# EAGLE board Controller Board (EAGLE 9.1.0), part 1 of 2
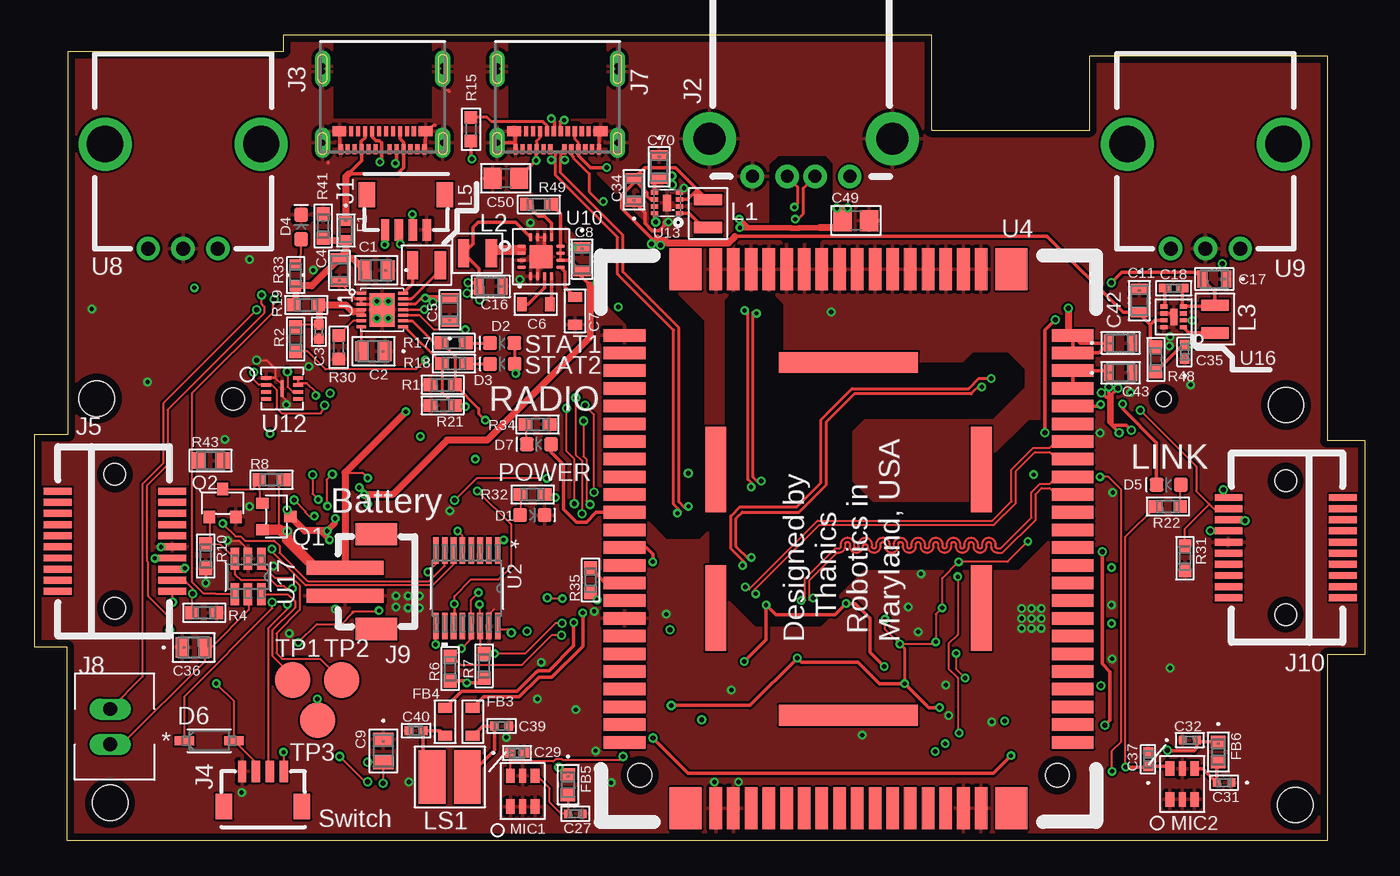
[diagram p6: board, top side]
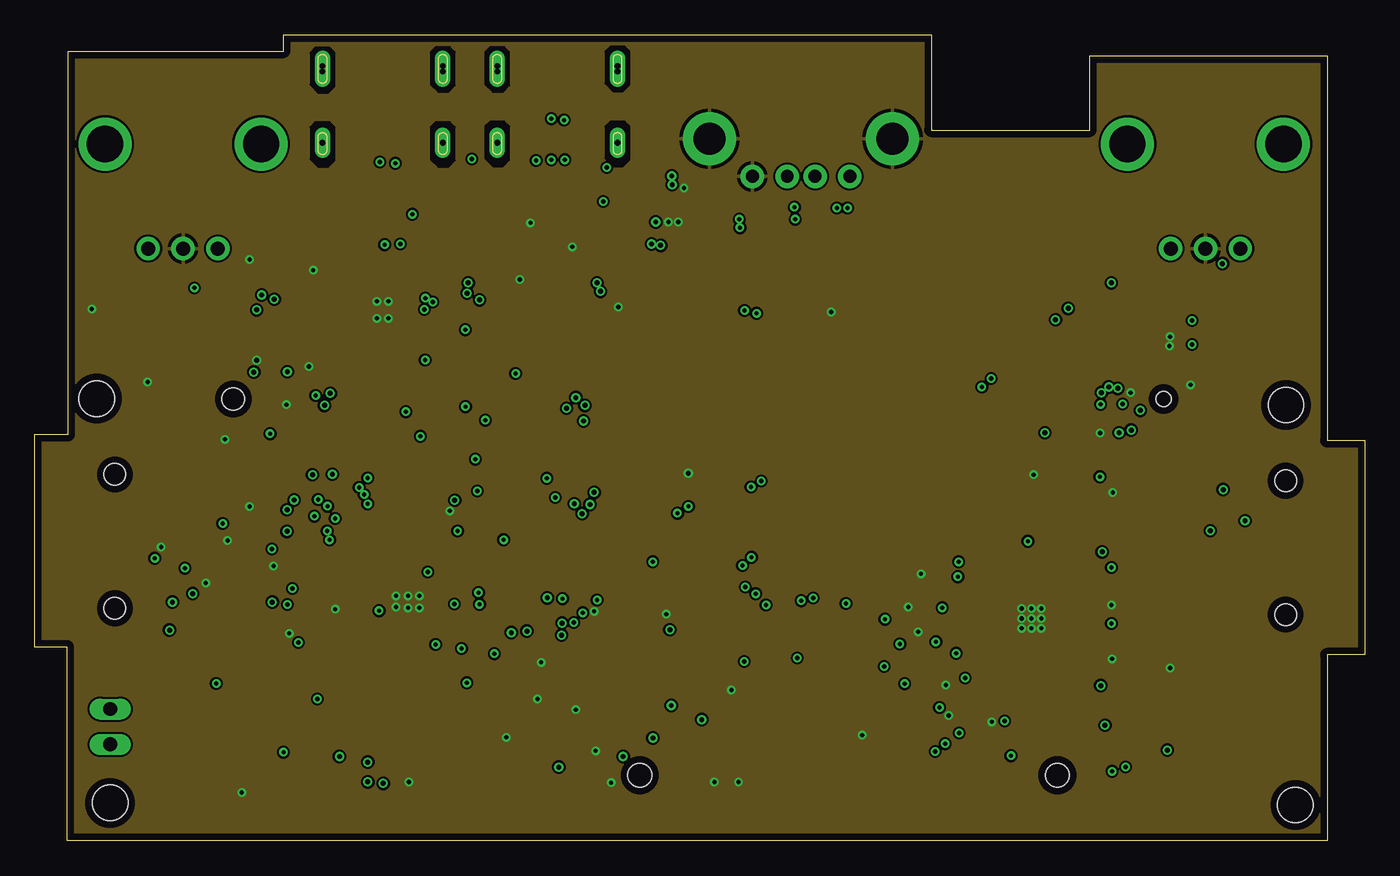
[diagram p7: board, inner layer Route2]
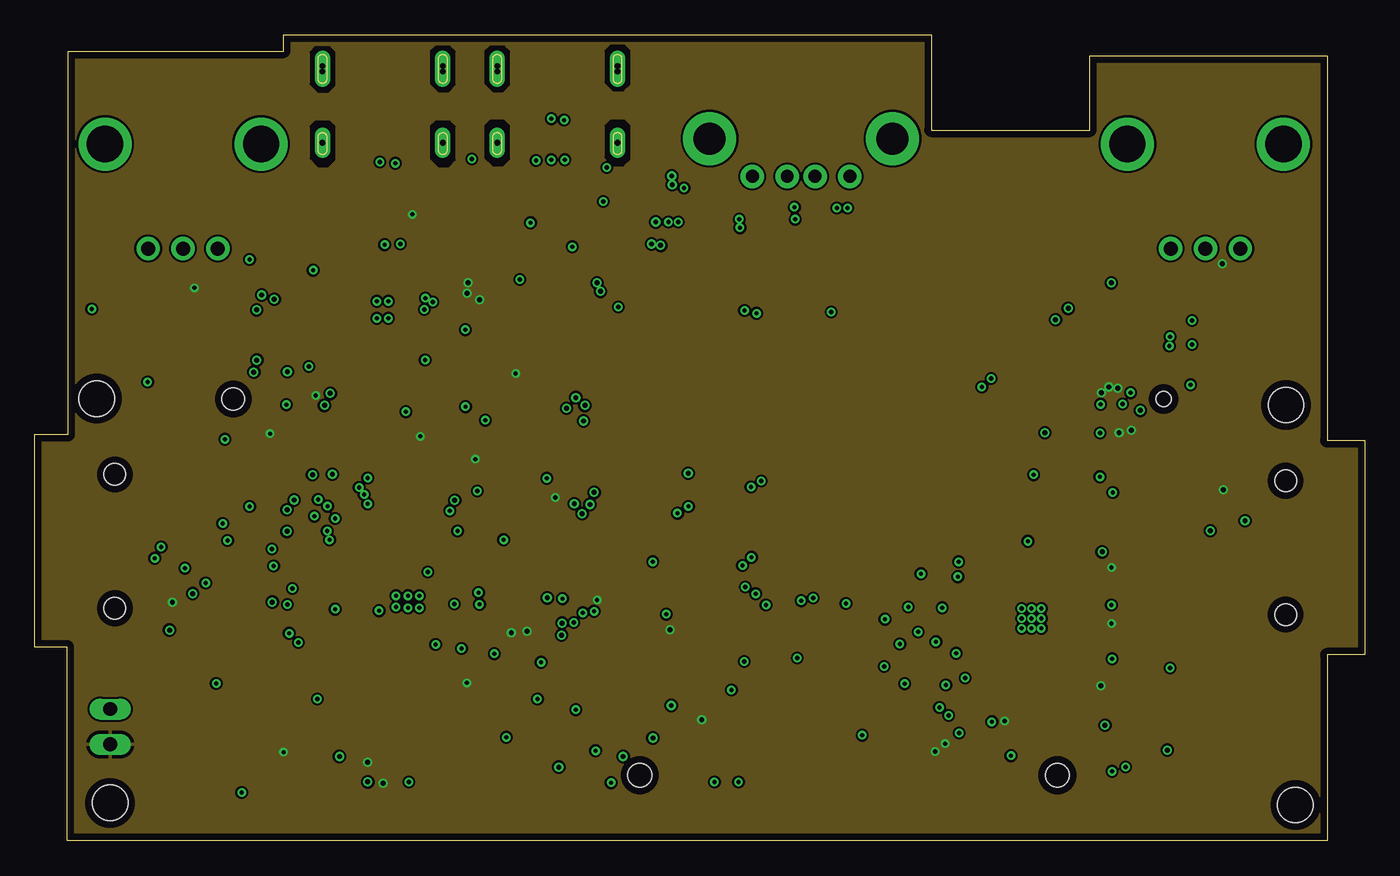
[diagram p8: board, inner layer Route15]
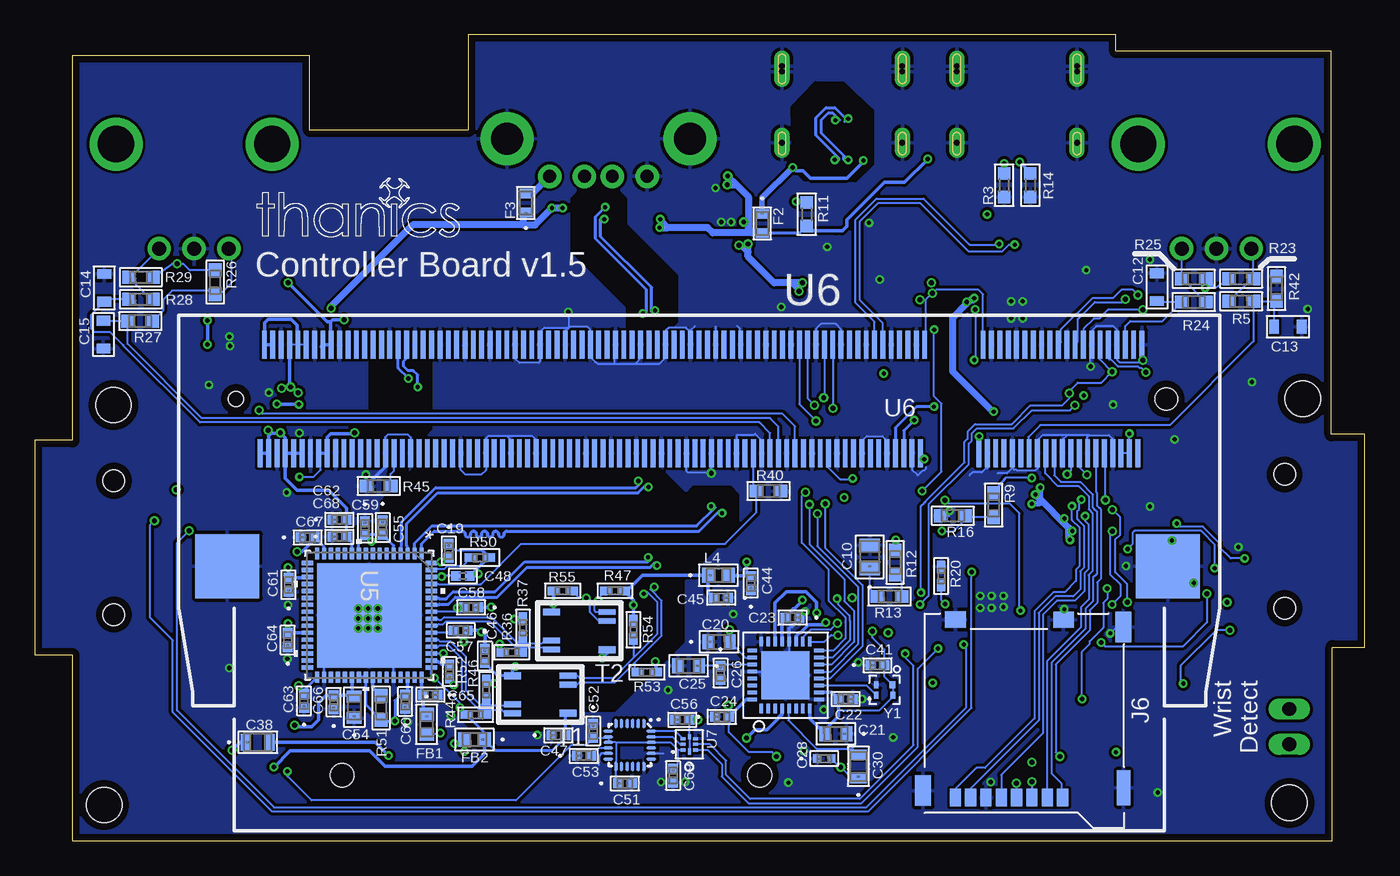
[diagram p9: board, bottom side, seen from below]

Size 95.48 x 57.84 mm. Coordinates in mm from the lower left corner, seen from the top.
Outline: 2.31,0 2.31,13.89 0,13.89 0,29.16 2.39,29.16 2.39,56.67 17.86,56.67 17.86,57.84 64.36,57.84 64.36,51 75.74,51 75.74,56.34 92.79,56.34 92.79,28.73 95.48,28.73 95.48,13.34 92.79,13.34 92.79,0 2.31,0
Copper layers (1*2*15*16): Top 0.035mm / dielectric 0.2mm / Route2 0.035mm / dielectric 1.2mm / Route15 0.035mm / dielectric 0.2mm / Bottom 0.035mm
Design rules "Elecrow_4-layer_PCB_eagle_rule": minimum track width 6mil, minimum drill 12mil, track to track 6mil, track to pad 6mil, pad to pad 6mil, via to via 8mil, smd to smd 0mil, copper to edge 20mil, drill to drill 10mil, minimum pad ring 6mil, minimum via ring 6mil, stop-mask expansion 0mil, vias tented up to drill 100mil, thermal gap 10mil
Holes 2.54 mm at 90.5,2.57 5.41,2.72 89.84,31.27 4.45,31.72

## Footprints (pad centres in the part's own frame; a part is rotated, then mirrored left to right if it is on the bottom)
0805 = smd 0.965 x 1.448: 1 -0.826,0; 2 0.826,0
C0402 = smd 0.7 x 0.7: 1 -0.5,0; 2 0.5,0
G-21 = smd 0.711 x 1.245: 1 -0.851,0; 2 0.851,0
0603_CAPACITOR = smd 0.701 x 1.001: 1 -1.001,0; 2 1.001,0
CC0402N-M = smd 0.864 x 0.61: 1 -0.635,0; 2 0.635,0
0402-M = smd 0.711 x 0.711: 1 -0.508,0; 2 0.508,0
0603-M = smd 0.813 x 1.067: 1 -0.775,0; 2 0.775,0
G-155-M = smd 0.559 x 0.61: 1 -0.521,0; 2 0.521,0
YAG_CC0402-M = smd 0.61 x 0.66: 1 -0.521,0; 2 0.521,0
C0805 = smd 1.3 x 1.5: 1 -0.95,0; 2 0.95,0
LED-0603 = smd 1 x 1: A -0.877,0; C 0.877,0
SOD123-M = smd 1.416 x 0.652: A 1.776,0; C -1.776,0
FUS_VISHAY_MFU0603 = smd 0.699 x 0.94: 1 -0.679,0; 2 0.679,0
IND_BLM18_0603-M = smd 0.914 x 1.041: 1 -0.724,0; 2 0.724,0
JST_SH_4POS = smd 0.6 x 1.55: 1 -1.5,0; 2 -0.5,0; 3 0.5,0; 4 1.5,0 | smd 1.2 x 1.8: P$5 -2.8,2.525; P$6 2.8,2.525
USB_A_RECEPT = drill 0.92 pad 1.676: 1 -3.5,0; 2 -1,0; 3 1,0; 4 3.5,0 | drill 2.3 pad 3.81: 5 -6.57,-2.71; 6 6.57,-2.71
MOLEX_105450-0101 = smd 0.3 x 0.7: A1 -3,3.77; A2 -2.5,3.77; A3 -2,3.77; A4 -1.5,3.77; A5 -1,3.77; A6 -0.5,3.77; A7 0.5,3.77; A8 1,3.77; A9 1.5,3.77; A10 2,3.77; A11 2.5,3.77; A12 3,3.77; B2 2.25,2.47; B3 1.75,2.47; B4 1.25,2.47; B5 0.75,2.47; B6 0.25,2.47; B7 -0.25,2.47; B8 -0.75,2.47; B9 -1.25,2.47; B10 -1.75,2.47; B11 -2.25,2.47 | smd 1 x 0.7: B1 3.1,2.47; B12 -3.1,2.47 | drill 0.4 pad 1.1 long: P$1 -4.32,3.3; P$2 -4.32,-2.2; P$3 -4.32,-1.8; P$4 4.32,3.3; P$5 4.32,-2.2; P$6 4.32,-1.8
EDGE_CONNECTOR_20POS = smd 0.5 x 2: 1 -3.6,0; 2 -2.8,0; 3 -2,0; 4 -1.2,0; 5 -0.4,0; 6 0.4,0; 7 1.2,0; 8 2,0; 9 2.8,0; 10 3.6,0; 11 3.6,8.2; 12 2.8,8.2; 13 2,8.2; 14 1.2,8.2; 15 0.4,8.2; 16 -0.4,8.2; 17 -1.2,8.2; 18 -2,8.2; 19 -2.8,8.2; 20 -3.6,8.2 | hole 1.55: -4.8,4.1; 4.8,4.1
MICROSD = smd 0.8 x 1.24: 1 -4.4,0; 2 -3.3,0; 3 -2.2,0; 4 -1.1,0; 5 0,0; 6 1.1,0; 7 2.2,0; 8 3.3,0 | smd 0.95 x 2.5: 9 -8.775,-0.7 | smd 1.15 x 2.2: 10 5.615,-0.5; 11 -8.775,-12.23 | smd 1.5 x 1.15: 12 -4.47,-12.755; 13 3.31,-12.775
XH_CONNECTOR = drill 1.001 long: 1 -1.27,0; 2 1.27,0
B2B-PH-SM4-TB(LF)(SN) = smd 1 x 5.5: 1 -1,0; 2 1,0 | smd 1.6 x 3: 3 3.4,2.25; 4 -3.4,2.25
1008 = smd 0.8 x 2: P$1 -1,0; P$2 1,0
470NH_INDUCTOR = smd 0.8 x 2: P$1 -1,0; P$2 1,0
SPEAKER = smd 1.905 x 3.81: 1 -1.27,0.889; 2 1.27,0.889
SISONIC_MICROPHONE = smd 1.032 x 0.622: 1 -1.104,0.884; 3 -1.104,-0.884; 4 1.104,-0.884; 6 1.104,0.884 | smd 1.032 x 0.5: 2 -1.104,0; 5 1.104,0
SOT-23_(TO-236AB) = smd 0.8 x 0.9: D 0,-1; G 0.95,1; S -0.95,1
RC0603N-M = smd 0.965 x 0.914: 1 -0.876,0; 2 0.876,0
R0603 = smd 0.9 x 0.9: 1 -0.85,0; 2 0.85,0
RC0402N-M = smd 0.864 x 0.61: 1 -0.66,0; 2 0.66,0
RC0603N = smd 0.762 x 0.813: 1 -0.775,0; 2 0.775,0
RC0805N = smd 1.006 x 1.2: 1 -0.853,0; 2 0.853,0
YAG_R0402-M = smd 0.66 x 0.66: 1 -0.508,0; 2 0.508,0
ALT4532 = smd 1.2 x 0.41: 1 -1.99,-1.35; 2 -1.99,-0.7; 4 1.99,1.35; 5 1.99,0.7 | smd 1.2 x 0.5: 3 -1.99,1.35; 6 1.99,-1.35
B2,54 = smd 2.54 x 2.54: TP 0,0
AAT3620_TDFN = smd 0.7 x 0.22: 1 -1.5,1.2; 2 -1.5,0.8; 3 -1.5,0.4; 4 -1.5,0; 5 -1.5,-0.4; 6 -1.5,-0.8; 7 -1.5,-1.2; 8 1.5,-1.2; 9 1.5,-0.8; 10 1.5,-0.4; 11 1.5,0; 12 1.5,0.4; 13 1.5,0.8; 14 1.5,1.2 | smd 1.8 x 2.4: EP 0,0
21-0055H_16-M = smd 1.905 x 0.406: 1 -2.705,2.223; 2 -2.705,1.587; 3 -2.705,0.953; 4 -2.705,0.318; 5 -2.705,-0.318; 6 -2.705,-0.953; 7 -2.705,-1.587; 8 -2.705,-2.223; 9 2.705,-2.223; 10 2.705,-1.587; 11 2.705,-0.953; 12 2.705,-0.318; 13 2.705,0.318; 14 2.705,0.953; 15 2.705,1.587; 16 2.705,2.223
PDDL2450_SOCKET = smd 0.9 x 3: 1 14.605,16.09; 2 13.335,16.09; 3 12.065,16.09; 4 10.795,16.09; 5 9.525,16.09; 6 8.255,16.09; 7 6.985,16.09; 8 5.715,16.09; 9 4.445,16.09; 10 3.175,16.09; 11 1.905,16.09; 12 0.635,16.09; 13 -0.635,16.09; 14 -1.905,16.09; 15 -3.175,16.09; 16 -4.445,16.09; 17 -5.715,16.09; 18 -6.985,16.09; 19 -8.255,16.09; 20 -9.525,16.09; 21 -10.795,16.09; 22 -12.065,16.09; 23 -13.335,16.09; 24 -14.605,16.09; 41 -14.605,-16.09; 42 -13.335,-16.09; 43 -12.065,-16.09; 44 -10.795,-16.09; 45 -9.525,-16.09; 46 -8.255,-16.09; 47 -6.985,-16.09; 48 -5.715,-16.09; 49 -4.445,-16.09; 50 -3.175,-16.09; 51 -1.905,-16.09; 52 -0.635,-16.09; 53 0.635,-16.09; 54 1.905,-16.09; 55 3.175,-16.09; 56 4.445,-16.09; 57 5.715,-16.09; 58 6.985,-16.09; 59 8.255,-16.09; 60 9.525,-16.09; 61 10.795,-16.09; 62 12.065,-16.09; 63 13.335,-16.09; 64 14.605,-16.09 | smd 3 x 0.9: 25 -19.34,9.53; 26 -19.34,8.26; 27 -19.34,6.99; 28 -19.34,5.72; 29 -19.34,4.45; 30 -19.34,3.18; 31 -19.34,1.91; 32 -19.34,0.64; 33 -19.34,-0.63; 34 -19.34,-1.9; 35 -19.34,-3.17; 36 -19.34,-4.44; 37 -19.34,-5.71; 38 -19.34,-6.98; 39 -19.34,-8.25; 40 -19.34,-9.52; 65 19.34,-9.52; 66 19.34,-8.25; 67 19.34,-6.98; 68 19.34,-5.71; 69 19.34,-4.44; 70 19.34,-3.17; 71 19.34,-1.9; 72 19.34,-0.63; 73 19.34,0.64; 74 19.34,1.91; 75 19.34,3.18; 76 19.34,4.45; 77 19.34,5.72; 78 19.34,6.99; 79 19.34,8.26; 80 19.34,9.53 | smd 1.5 x 10: EP1 -12.65,0; EP2 12.65,0 | smd 6.15 x 1.5: EP3 -4.975,9.53; EP4 4.975,9.53; EP5 -4.975,-9.53; EP6 4.975,-9.53 | smd 3 x 2.3: P$7 -19.34,11.7; P$8 -19.34,-11.7; P$9 19.34,11.7; P$10 19.34,-11.7 | hole 1.7: -16.97,14.985; -16.97,-14.985
QFN64_9X9MC-M = smd 0.813 x 0.305: 1 -4.445,3.75; 2 -4.445,3.25; 3 -4.445,2.75; 4 -4.445,2.25; 5 -4.445,1.75; 6 -4.445,1.25; 7 -4.445,0.75; 8 -4.445,0.25; 9 -4.445,-0.25; 10 -4.445,-0.75; 11 -4.445,-1.25; 12 -4.445,-1.75; 13 -4.445,-2.25; 14 -4.445,-2.75; 15 -4.445,-3.25; 16 -4.445,-3.75; 33 4.445,-3.75; 34 4.445,-3.25; 35 4.445,-2.75; 36 4.445,-2.25; 37 4.445,-1.75; 38 4.445,-1.25; 39 4.445,-0.75; 40 4.445,-0.25; 41 4.445,0.25; 42 4.445,0.75; 43 4.445,1.25; 44 4.445,1.75; 45 4.445,2.25; 46 4.445,2.75; 47 4.445,3.25; 48 4.445,3.75 | smd 0.305 x 0.813: 17 -3.75,-4.445; 18 -3.25,-4.445; 19 -2.75,-4.445; 20 -2.25,-4.445; 21 -1.75,-4.445; 22 -1.25,-4.445; 23 -0.75,-4.445; 24 -0.25,-4.445; 25 0.25,-4.445; 26 0.75,-4.445; 27 1.25,-4.445; 28 1.75,-4.445; 29 2.25,-4.445; 30 2.75,-4.445; 31 3.25,-4.445; 32 3.75,-4.445; 49 3.75,4.445; 50 3.25,4.445; 51 2.75,4.445; 52 2.25,4.445; 53 1.75,4.445; 54 1.25,4.445; 55 0.75,4.445; 56 0.25,4.445; 57 -0.25,4.445; 58 -0.75,4.445; 59 -1.25,4.445; 60 -1.75,4.445; 61 -2.25,4.445; 62 -2.75,4.445; 63 -3.25,4.445; 64 -3.75,4.445 | smd 7.493 x 7.493: 65 0,0
SO-DIMM = smd 0.35 x 2: 1 -26.4,-3.9; 2 -26.1,3.9; 3 -25.8,-3.9; 4 -25.5,3.9; 5 -25.2,-3.9; 6 -24.9,3.9; 7 -24.6,-3.9; 8 -24.3,3.9; 9 -24,-3.9; 10 -23.7,3.9; 11 -23.4,-3.9; 12 -23.1,3.9; 13 -22.8,-3.9; 14 -22.5,3.9; 15 -22.2,-3.9; 16 -21.9,3.9; 17 -21.6,-3.9; 18 -21.3,3.9; 19 -21,-3.9; 20 -20.7,3.9; 21 -20.4,-3.9; 22 -20.1,3.9; 23 -19.8,-3.9; 24 -19.5,3.9; 25 -19.2,-3.9; 26 -18.9,3.9; 27 -18.6,-3.9; 28 -18.3,3.9; 29 -18,-3.9; 30 -17.7,3.9; 31 -17.4,-3.9; 32 -17.1,3.9; 33 -16.8,-3.9; 34 -16.5,3.9; 35 -16.2,-3.9; 36 -15.9,3.9; 37 -15.6,-3.9; 38 -15.3,3.9; 39 -15,-3.9; 40 -14.7,3.9; 41 -10.8,-3.9; 42 -10.5,3.9; 43 -10.2,-3.9; 44 -9.9,3.9; 45 -9.6,-3.9; 46 -9.3,3.9; 47 -9,-3.9; 48 -8.7,3.9; 49 -8.4,-3.9; 50 -8.1,3.9; 51 -7.8,-3.9; 52 -7.5,3.9; 53 -7.2,-3.9; 54 -6.9,3.9; 55 -6.6,-3.9; 56 -6.3,3.9; 57 -6,-3.9; 58 -5.7,3.9; 59 -5.4,-3.9; 60 -5.1,3.9; 61 -4.8,-3.9; 62 -4.5,3.9; 63 -4.2,-3.9; 64 -3.9,3.9; 65 -3.6,-3.9; 66 -3.3,3.9; 67 -3,-3.9; 68 -2.7,3.9; 69 -2.4,-3.9; 70 -2.1,3.9; 71 -1.8,-3.9; 72 -1.5,3.9; 73 -1.2,-3.9; 74 -0.9,3.9; 75 -0.6,-3.9; 76 -0.3,3.9; 77 0,-3.9; 78 0.3,3.9; 79 0.6,-3.9; 80 0.9,3.9; 81 1.2,-3.9; 82 1.5,3.9; 83 1.8,-3.9; 84 2.1,3.9; 85 2.4,-3.9; 86 2.7,3.9; 87 3,-3.9; 88 3.3,3.9; 89 3.6,-3.9; 90 3.9,3.9; 91 4.2,-3.9; 92 4.5,3.9; 93 4.8,-3.9; 94 5.1,3.9; 95 5.4,-3.9; 96 5.7,3.9; 97 6,-3.9; 98 6.3,3.9; 99 6.6,-3.9; 100 6.9,3.9; 101 7.2,-3.9; 102 7.5,3.9; 103 7.8,-3.9; 104 8.1,3.9; 105 8.4,-3.9; 106 8.7,3.9; 107 9,-3.9; 108 9.3,3.9; 109 9.6,-3.9; 110 9.9,3.9; 111 10.2,-3.9; 112 10.5,3.9; 113 10.8,-3.9; 114 11.1,3.9; 115 11.4,-3.9; 116 11.7,3.9; 117 12,-3.9; 118 12.3,3.9; 119 12.6,-3.9; 120 12.9,3.9; 121 13.2,-3.9; 122 13.5,3.9; 123 13.8,-3.9; 124 14.1,3.9; 125 14.4,-3.9; 126 14.7,3.9; 127 15,-3.9; 128 15.3,3.9; 129 15.6,-3.9; 130 15.9,3.9; 131 16.2,-3.9; 132 16.5,3.9; 133 16.8,-3.9; 134 17.1,3.9; 135 17.4,-3.9; 136 17.7,3.9; 137 18,-3.9; 138 18.3,3.9; 139 18.6,-3.9; 140 18.9,3.9; 141 19.2,-3.9; 142 19.5,3.9; 143 19.8,-3.9; 144 20.1,3.9; 145 20.4,-3.9; 146 20.7,3.9; 147 21,-3.9; 148 21.3,3.9; 149 21.6,-3.9; 150 21.9,3.9; 151 22.2,-3.9; 152 22.5,3.9; 153 22.8,-3.9; 154 23.1,3.9; 155 23.4,-3.9; 156 23.7,3.9; 157 24,-3.9; 158 24.3,3.9; 159 24.6,-3.9; 160 24.9,3.9; 161 25.2,-3.9; 162 25.5,3.9; 163 25.8,-3.9; 164 26.1,3.9; 165 26.4,-3.9; 166 26.7,3.9; 167 27,-3.9; 168 27.3,3.9; 169 27.6,-3.9; 170 27.9,3.9; 171 28.2,-3.9; 172 28.5,3.9; 173 28.8,-3.9; 174 29.1,3.9; 175 29.4,-3.9; 176 29.7,3.9; 177 30,-3.9; 178 30.3,3.9; 179 30.6,-3.9; 180 30.9,3.9; 181 31.2,-3.9; 182 31.5,3.9; 183 31.8,-3.9; 184 32.1,3.9; 185 32.4,-3.9; 186 32.7,3.9; 187 33,-3.9; 188 33.3,3.9; 189 33.6,-3.9; 190 33.9,3.9; 191 34.2,-3.9; 192 34.5,3.9; 193 34.8,-3.9; 194 35.1,3.9; 195 35.4,-3.9; 196 35.7,3.9; 197 36,-3.9; 198 36.3,3.9; 199 36.6,-3.9; 200 36.9,3.9 | smd 4.6 x 4.6: G1 -28.254,12; G2 39.27,12 | hole 1.6: -28.15,0 | hole 1.1: 38.65,0
8-UMLP = smd 0.45 x 0.22: 1 -0.5,0 | smd 0.22 x 0.35: 2 -0.4,-0.45; 3 0,-0.45; 4 0.4,-0.45; 6 0.4,0.45; 7 0,0.45; 8 -0.4,0.45 | smd 0.35 x 0.22: 5 0.55,0
PEC12R = drill 2.6 pad 3.81: 1 -5.6,7.5; 2 5.6,7.5 | drill 1 pad 1.676: A -2.5,0; B 2.5,0; C 0,0
VQFN16 = smd 0.6 x 0.24: 1 -1.4,0.75; 2 -1.4,0.25; 3 -1.4,-0.25; 4 -1.4,-0.75; 9 1.4,-0.75; 10 1.4,-0.25; 11 1.4,0.25; 12 1.4,0.75 | smd 0.24 x 0.6: 5 -0.75,-1.4; 6 -0.25,-1.4; 7 0.25,-1.4; 8 0.75,-1.4; 13 0.75,1.4; 14 0.25,1.4; 15 -0.25,1.4; 16 -0.75,1.4 | smd 1.68 x 1.68: 17 0,0
QFN40P300X300X105-25N = smd 0.7 x 0.2: 1 -1.55,1; 2 -1.55,0.6; 3 -1.55,0.2; 4 -1.55,-0.2; 5 -1.55,-0.6; 6 -1.55,-1; 13 1.55,-1; 14 1.55,-0.6; 15 1.55,-0.2; 16 1.55,0.2; 17 1.55,0.6; 18 1.55,1 | smd 0.2 x 0.7: 7 -1,-1.55; 8 -0.6,-1.55; 9 -0.2,-1.55; 10 0.2,-1.55; 11 0.6,-1.55; 12 1,-1.55; 19 1,1.55; 20 0.6,1.55; 21 0.2,1.55; 22 -0.2,1.55; 23 -0.6,1.55; 24 -1,1.55
PG-USON-8-1 = smd 0.7 x 0.25: 1 -1.15,0.75; 2 -1.15,0.25; 3 -1.15,-0.25; 4 -1.15,-0.75; 5 1.15,-0.75; 6 1.15,-0.25; 7 1.15,0.25; 8 1.15,0.75 | smd 0.2 x 1.2: 9 0,0
UDFN8 = smd 0.3 x 0.5: 1 -0.75,-0.9; 2 -0.25,-0.9; 3 0.25,-0.9; 4 0.75,-0.9; 5 0.75,0.9; 6 0.25,0.9; 7 -0.25,0.9; 8 -0.75,0.9 | smd 1.2 x 0.6: EP 0,0
MLF(ML)_8PIN = smd 0.5 x 0.3: 1 -0.7,0.75; 2 -0.7,0.25; 3 -0.7,-0.25; 4 -0.7,-0.75; 5 0.7,-0.75; 6 0.7,-0.25; 7 0.7,0.25; 8 0.7,0.75 | smd 0.5 x 1.2: EP 0,0
6ST1-M = smd 1.575 x 0.61: 1 -1.27,0.95; 2 -1.27,0; 3 -1.27,-0.95; 4 1.27,-0.95; 5 1.27,0; 6 1.27,0.95
32QFN = smd 0.7 x 0.25: 1 -2.4,1.75; 2 -2.4,1.25; 3 -2.4,0.75; 4 -2.4,0.25; 5 -2.4,-0.25; 6 -2.4,-0.75; 7 -2.4,-1.25; 8 -2.4,-1.75; 17 2.4,-1.75; 18 2.4,-1.25; 19 2.4,-0.75; 20 2.4,-0.25; 21 2.4,0.25; 22 2.4,0.75; 23 2.4,1.25; 24 2.4,1.75 | smd 0.25 x 0.7: 9 -1.75,-2.4; 10 -1.25,-2.4; 11 -0.75,-2.4; 12 -0.25,-2.4; 13 0.25,-2.4; 14 0.75,-2.4; 15 1.25,-2.4; 16 1.75,-2.4; 25 1.75,2.4; 26 1.25,2.4; 27 0.75,2.4; 28 0.25,2.4; 29 -0.25,2.4; 30 -0.75,2.4; 31 -1.25,2.4; 32 -1.75,2.4 | smd 3.45 x 3.45: EP 0,0
4-VFLGA = smd 0.43 x 0.5: 1 -0.56,-0.375 | smd 0.35 x 0.5: 2 0.6,-0.375; 3 0.6,0.375; 4 -0.6,0.375

## Placement (x,y rotation side)
C1  0.1uF  [0805]  24.51,40.94 180 top
C2  0.1uF  [0805]  24.31,35.13 180 top
C3  1uF  [C0402]  20.4,36.53 270 top
C4  10uF  [G-21]  21.87,40.94 90 top
C5  22uF  [G-21]  29.79,38.1 90 top
C6  10nF  [0603_CAPACITOR]  35.97,38.51 180 top
C7  10nF  [0603_CAPACITOR]  38.79,38.02 90 top
C8  10uF  [G-21]  39.29,41.73 270 top
C9  0.1uF  [0805]  25.02,6.45 270 top
C10  0.1uF  [0805]  35.53,20.37 90 bottom
C11  10uF  [G-21]  79.3,38.76 270 top
C12  10nF  [0603_CAPACITOR]  14.91,39.73 270 bottom
C13  10nF  [0603_CAPACITOR]  5.51,36.88 180 bottom
C14  10nF  [0603_CAPACITOR]  90.5,39.67 270 bottom
C15  10nF  [0603_CAPACITOR]  90.55,36.32 90 bottom
C16  22uF  [G-21]  32.74,39.78 180 top
C17  10uF  [G-21]  84.68,40.31 180 top
C18  560pF  [CC0402N-M]  81.76,39.65 0 top
C19  0.1uF  [0402-M]  65.76,20.8 270 bottom
C20  4.7uF  [0603-M]  46.36,14.27 0 bottom
C21  4.7uF  [0603-M]  37.97,7.67 180 bottom
C22  0.1uF  [0402-M]  37.26,10.16 180 bottom
C23  0.1uF  [0402-M]  41.07,16 180 bottom
C24  0.1uF  [0402-M]  46.15,8.89 0 bottom
C25  4.7uF  [0603-M]  48.54,12.55 180 bottom
C26  0.1uF  [0402-M]  46.25,12.04 270 bottom
C27  33pF  [G-155-M]  38.8,1.93 180 top
C28  33pF  [G-155-M]  38.8,5.89 0 bottom
C29  0.1uF  [0402-M]  34.62,6.3 0 top
C30  10uF  [G-21]  36.35,5.33 90 bottom
C31  33pF  [G-155-M]  85.38,4.17 180 top
C32  33pF  [G-155-M]  82.92,7.21 0 top
C34  10uF  [G-21]  43.03,46.71 90 top
C35  0.1uF  [0402-M]  82.55,35.08 90 top
C36  0.1uF  [0805]  11.4,13.87 0 top
C37  0.1uF  [0402-M]  79.93,5.84 90 top
C38  10uF  [G-21]  79.48,7.06 0 bottom
C39  100pF  [YAG_CC0402-M]  33.52,8.23 180 top
C40  100pF  [YAG_CC0402-M]  27.37,7.9 0 top
C41  0.1uF  [0402-M]  34.98,12.6 0 bottom
C42  22uF  [G-21]  77.95,35.71 0 top
C43  10uF  [G-21]  77.95,33.58 0 top
C44  0.1uF  [0402-M]  44.07,18.49 90 bottom
C45  0.1uF  [0402-M]  46.2,17.42 180 bottom
C46  0.1uF  [0402-M]  63.17,13.26 270 bottom
C47  0.1uF  [0402-M]  57.89,7.57 0 bottom
C48  1uF  [C0402]  64.74,19 0 bottom
C49  22uF  [C0805]  58.95,44.5 0 top
C50  22uF  [C0805]  33.81,47.55 180 top
C51  0.1uF  [0402-M]  53.11,4.11 0 bottom
C52  0.1uF  [0402-M]  55.4,7.87 270 bottom
C53  0.1uF  [0402-M]  56.06,6.1 0 bottom
C54  4.7uF  [0603-M]  72.54,9.58 90 bottom
C55  0.1uF  [0402-M]  70.51,22.48 270 bottom
C56  0.1uF  [0402-M]  49,8.69 0 bottom
C57  0.1uF  [0402-M]  64.9,15.09 180 bottom
C58  0.1uF  [0402-M]  64.16,16.74 180 bottom
C59  0.1uF  [0402-M]  71.78,22.43 270 bottom
C60  0.1uF  [0402-M]  68.88,9.98 90 bottom
C61  0.1uF  [0402-M]  77.27,18.36 90 bottom
C62  0.1uF  [0402-M]  73.61,23.04 0 bottom
C63  0.1uF  [0402-M]  76.15,10.03 90 bottom
C64  0.1uF  [0402-M]  77.32,14.4 90 bottom
C65  0.1uF  [0402-M]  67.08,10.46 180 bottom
C66  0.1uF  [0402-M]  74.02,9.93 90 bottom
C67  0.1uF  [0402-M]  75.9,21.77 0 bottom
C68  0.1uF  [0402-M]  73.61,21.82 0 bottom
C69  0.1uF  [0402-M]  49.66,4.67 270 bottom
C70  22uF  [G-21]  44.83,48.36 270 top
D1  GREEN  [LED-0603]  35.71,23.37 0 top
D2  GREEN  [LED-0603]  33.55,35.71 180 top
D3  GREEN  [LED-0603]  33.57,34.21 180 top
D4  GREEN  [LED-0603]  19.13,44.04 90 top
D5  GREEN  [LED-0603]  81.41,25.55 180 top
D6  [SOD123-M]  12.52,7.16 0 top
D7  GREEN  [LED-0603]  36.2,28.45 180 top
F1  MFU0603FF01600P100  [FUS_VISHAY_MFU0603]  22.33,43.79 270 top
F2  MFU0603FF01600P100  [FUS_VISHAY_MFU0603]  43.26,44.3 270 bottom
F3  MFU0603FF01600P100  [FUS_VISHAY_MFU0603]  60.22,45.77 90 bottom
FB1  600R  [IND_BLM18_0603-M]  67.35,8.35 270 bottom
FB2  600R  [IND_BLM18_0603-M]  63.91,7.26 180 bottom
FB3  CIM10J121NC  [0603_CAPACITOR]  31.45,8.53 270 top
FB4  CIM10J121NC  [0603_CAPACITOR]  29.46,8.53 270 top
FB5  2.5k  [IND_BLM18_0603-M]  38.28,4.03 270 top
FB6  2.5k  [IND_BLM18_0603-M]  84.96,6.36 270 top
J1  [JST_SH_4POS]  26.64,43.84 0 top
J2  USB_A_RECEPT  [USB_A_RECEPT]  55.02,47.68 180 top
J3  105450-0101  [MOLEX_105450-0101]  24.97,53.39 180 top
J4  [JST_SH_4POS]  16.38,4.98 180 top
J5  EDGE_CONNECTOR_20POS  [EDGE_CONNECTOR_20POS]  1.65,21.49 270 top
J6  MICROSD  [MICROSD]  26.09,3.1 180 bottom
J7  105450-0101  [MOLEX_105450-0101]  37.52,53.39 180 top
J8  2_PIN_CONNECTOR  [XH_CONNECTOR]  5.41,8.18 270 top
J9  B2B-PH-SM4-TB(LF)(SN)  [B2B-PH-SM4-TB(LF)(SN)]  22.28,18.59 270 top
J10  EDGE_CONNECTOR_20POS  [EDGE_CONNECTOR_20POS]  93.9,21.03 90 top
L1  4.7uH  [1008]  48.34,45.01 90 top
L2  470nH  [470NH_INDUCTOR]  31.78,42.16 180 top
L3  470nH  [470NH_INDUCTOR]  84.73,37.44 90 top
L4  1k@100MHz  [IND_BLM18_0603-M]  46.41,19.05 0 bottom
L5  4.7uH  [1008]  28.12,41.3 0 top
LS1  [SPEAKER]  29.79,5.46 180 top
MIC1  [SISONIC_MICROPHONE]  35.03,3.56 90 top
MIC2  [SISONIC_MICROPHONE]  82.37,4.06 90 top
Q1  [SOT-23_(TO-236AB)]  17.35,23.27 90 top
Q2  2N7002P_MOSFET  [SOT-23_(TO-236AB)]  13.49,24.23 180 top
R1  10k  [RC0603N-M]  29.29,32.72 180 top
R2  10k  [RC0603N-M]  18.72,35.99 270 top
R3  5.1k  [R0603]  25.88,47.04 90 bottom
R4  10k  [RC0603N-M]  12.17,16.36 0 top
R5  10k  [RC0603N-M]  8.86,38.71 0 bottom
R6  1k  [RC0603N-M]  29.82,12.34 90 top
R7  1k  [RC0603N-M]  32.26,12.55 90 top
R8  10k  [RC0603N-M]  16.99,25.91 0 top
R9  10k  [RC0603N-M]  26.64,24.08 270 bottom
R10  10k  [RC0603N-M]  12.27,20.42 270 top
R11  22k  [R0603]  40.06,44.96 270 bottom
R12  1k  [RC0603N-M]  33.71,19.96 270 bottom
R13  1k  [RC0603N-M]  34.11,17.53 180 bottom
R14  5.1k  [R0603]  24,47.04 90 bottom
R15  22k  [R0603]  31.32,51.05 270 top
R16  10k  [RC0603N-M]  29.57,23.32 180 bottom
R17  1k  [RC0603N-M]  30.07,35.74 0 top
R18  1k  [RC0603N-M]  30.1,34.24 0 top
R19  100R  [RC0603N-M]  19.48,38.46 0 top
R20  24.9k  [RC0402N-M]  30.4,19 270 bottom
R21  10k  [RC0603N-M]  29.29,31.24 180 top
R22  1k  [RC0603N-M]  81.36,23.98 180 top
R23  10k  [RC0603N-M]  8.86,40.34 0 bottom
R24  10k  [RC0603N-M]  12.27,38.66 180 bottom
R25  10k  [RC0603N-M]  12.27,40.34 180 bottom
R26  10k  [RC0603N-M]  82.52,40.08 270 bottom
R27  10k  [RC0603N-M]  87.91,37.29 180 bottom
R28  10k  [RC0603N-M]  87.86,38.86 180 bottom
R29  10k  [RC0603N-M]  87.86,40.44 180 bottom
R30  75k  [R0603]  21.82,35.41 90 top
R31  10k  [RC0603N-M]  82.58,20.27 270 top
R32  20R  [RC0603N-M]  35.74,24.84 0 top
R33  340R  [RC0603N]  18.72,40.59 270 top
R34  1k  [RC0603N-M]  36.09,29.87 0 top
R35  10k  [RC0603N-M]  39.9,18.69 90 top
R36  49R9  [RC0402N-M]  61.24,13.51 0 bottom
R37  49R9  [RC0402N-M]  60.43,15.29 270 bottom
R40  100k  [RC0603N-M]  42.8,25.1 0 bottom
R41  10k  [RC0603N-M]  20.7,44.12 90 top
R42  100k  [RC0603N-M]  6.32,39.62 90 bottom
R43  10k  [RC0805N]  12.62,27.28 0 top
R44  49R9  [RC0402N-M]  63.83,9.04 0 bottom
R45  10k  [RC0603N-M]  70.79,25.45 180 bottom
R46  49R9  [RC0402N-M]  63.07,10.82 270 bottom
R47  49R9  [RC0402N-M]  53.82,17.93 180 bottom
R48  100k  [RC0603N-M]  80.49,34.54 90 top
R49  100k  [RC0603N-M]  36.2,45.67 180 top
R50  12k  [RC0402N-M]  63.51,20.32 0 bottom
R51  10k  [RC0603N-M]  70.62,9.53 270 bottom
R52  12.4k  [YAG_R0402-M]  65.71,12.14 90 bottom
R53  49R9  [RC0402N-M]  51.54,12.09 180 bottom
R54  49R9  [RC0402N-M]  52.5,15.14 270 bottom
R55  49R9  [RC0402N-M]  57.58,17.93 0 bottom
T1  ALT4532M  [ALT4532]  59.18,10.49 180 bottom
T2  ALT4532M  [ALT4532]  56.39,15.06 180 bottom
TP1  TPB2,54  [B2,54]  18.52,11.53 0 top
TP2  TPB2,54  [B2,54]  22.02,11.53 0 top
TP3  TPB2,54  [B2,54]  20.29,8.64 180 top
U1  AAT3620_BATT_CHARGER  [AAT3620_TDFN]  24.94,38.1 0 top
U2  8 CH  [21-0055H_16-M]  31.01,18.11 270 top
U4  PDDL2450  [PDDL2450_SOCKET]  58.42,21.67 90 top
U5  [QFN64_9X9MC-M]  71.47,16.18 270 bottom
U6  [SO-DIMM]  42.39,31.7 180 bottom
U7  [8-UMLP]  48.49,6.91 90 bottom
U8  PEC12R  [PEC12R]  10.64,42.49 0 top
U9  PEC12R  [PEC12R]  84.05,42.49 0 top
U10  TPS6209  [VQFN16]  36.35,41.91 0 top
U11  [QFN40P300X300X105-25N]  52.76,6.86 270 bottom
U12  APPLE_2.0C_COPROCESSOR  [PG-USON-8-1]  17.75,32.46 0 top
U13  MIC2876UDFN-8  [UDFN8]  45.39,45.77 90 top
U16  MIC23050  [MLF(ML)_8PIN]  81.76,37.59 180 top
U17  [6ST1-M]  15.32,18.95 270 top
U19  WM8960  [32QFN]  41.58,11.89 90 bottom
Y1  DSC6001  [4-VFLGA]  34.47,10.82 180 bottom